# EAGLE schematic position_sensor (EAGLE 8.2.1)
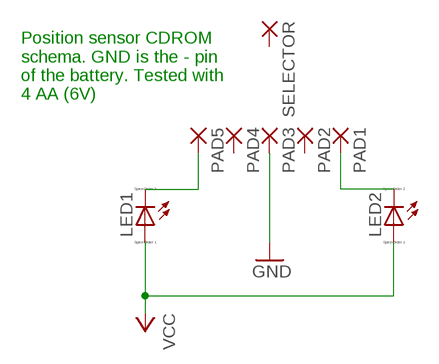
[diagram p0: schematic, sheet 1]

## Parts
LED1  LED_ELD260  [LED_LD260]
LED2  LED_ELD260  [LED_LD260]
PAD1  SMD2  [SMD1,27-2,54]
PAD2  SMD2  [SMD1,27-2,54]
PAD3  SMD2  [SMD1,27-2,54]
PAD4  SMD2  [SMD1,27-2,54]
PAD5  SMD2  [SMD1,27-2,54]
SELECTOR  SMD2  [SMD1,27-2,54]

## Nets
GND: PAD3.1(P)
N$1: LED1.K(C) PAD5.1(P)
N$2: LED2.K(C) PAD1.1(P)
VCC: LED1.A LED2.A
Unconnected: PAD2.1(P) PAD4.1(P) SELECTOR.1(P)

## Notes on the sheet
- Position sensor CDROM
  schema. GND is the - pin
  of the battery. Tested with
  4 AA (6V)

## Library data of the parts
LED1 LED2 = eagle-ltspice:LED_E: LED Source: http://www.osram.convergy.de Source: www.luxeon.com Source: www.kingbright.com; SPICEMODEL: NONE; SPICEPREFIX: D; SPICETYPE: diode
PAD1-PAD5 SELECTOR = wirepad:SMD2: SMD PAD